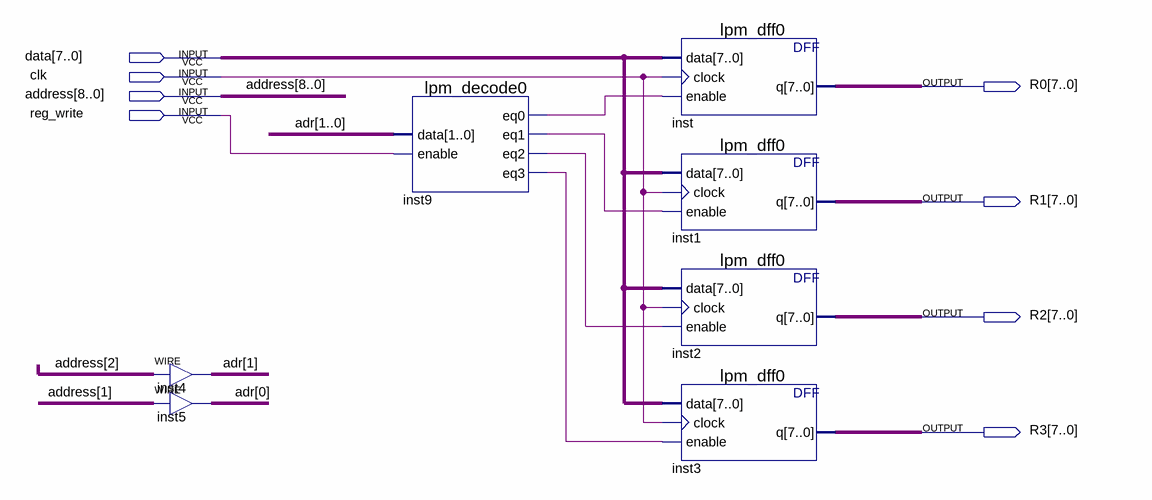
[diagram p0: schematic sheet]
// Quartus schematic POH.bdf as structural Verilog: 7 symbols, 8 pins
module POH (
  input  [7:0] data,
  input  clk,
  input  [8:0] address,
  input  reg_write,
  output [7:0] R0,
  output [7:0] R1,
  output [7:0] R2,
  output [7:0] R3
);

  wire inst9_eq0, inst9_eq1, inst9_eq2, inst9_eq3;
  wire [1:0] adr;

  assign adr[1] = address[2];  // WIRE inst4
  assign adr[0] = address[1];  // WIRE inst5
  lpm_decode0 inst9 (
    .data(adr), .enable(reg_write), .eq0(inst9_eq0), .eq1(inst9_eq1), .eq2(inst9_eq2), .eq3(inst9_eq3));
  lpm_dff0 inst (.data(data), .clock(clk), .enable(inst9_eq0), .q(R0));
  lpm_dff0 inst1 (.data(data), .clock(clk), .enable(inst9_eq1), .q(R1));
  lpm_dff0 inst2 (.data(data), .clock(clk), .enable(inst9_eq2), .q(R2));
  lpm_dff0 inst3 (.data(data), .clock(clk), .enable(inst9_eq3), .q(R3));
endmodule
